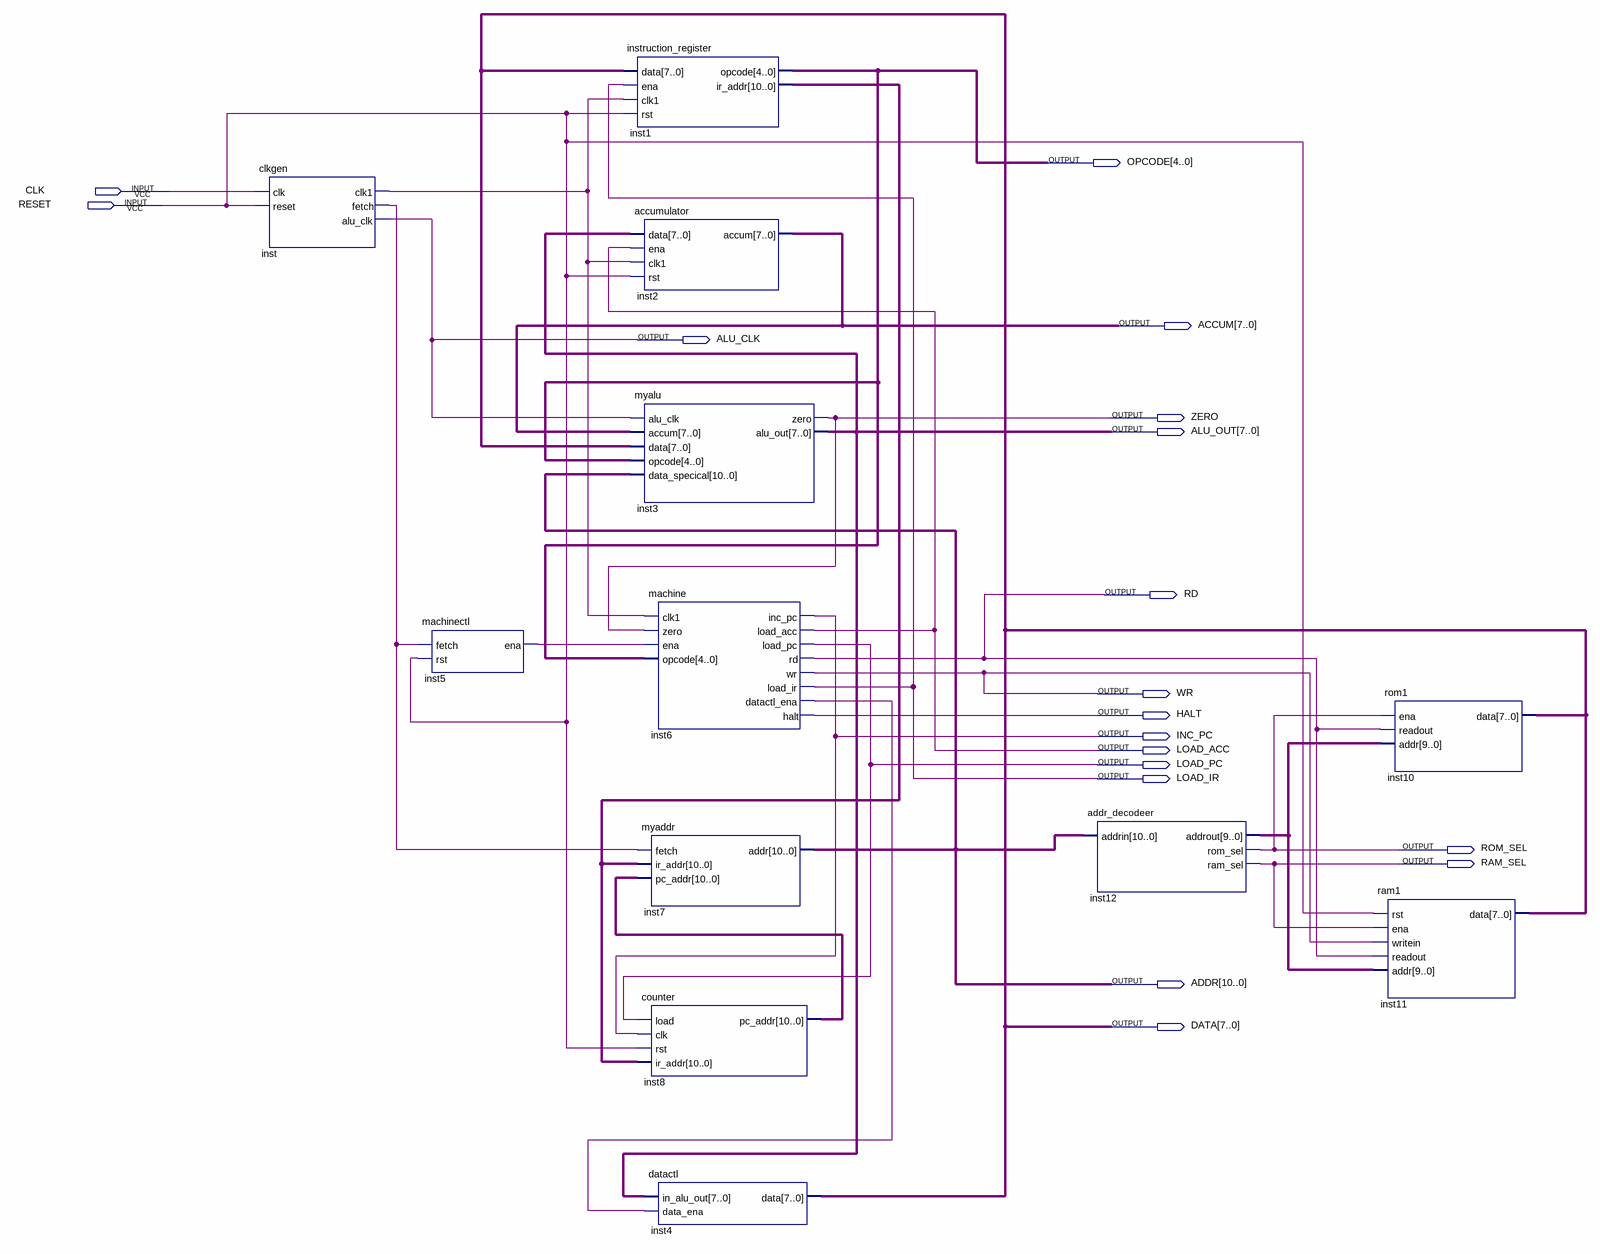
[diagram p0: schematic sheet]
// Quartus schematic RISC_CPU_TPO.bdf as structural Verilog: 12 symbols, 18 pins
module RISC_CPU_TPO (
  input  CLK,
  input  RESET,
  output [4:0] OPCODE,
  output [7:0] ACCUM,
  output ALU_CLK,
  output ZERO,
  output [7:0] ALU_OUT,
  output RD,
  output WR,
  output HALT,
  output INC_PC,
  output LOAD_ACC,
  output LOAD_PC,
  output LOAD_IR,
  output ROM_SEL,
  output RAM_SEL,
  output [10:0] ADDR,
  output [7:0] DATA
);

  wire inst5_ena, inst6_datactl_ena, inst_clk1, inst_fetch;
  wire [9:0] inst12_addrout;
  wire [10:0] inst1_ir_addr, inst8_pc_addr;

  clkgen inst (.clk(CLK), .reset(RESET), .clk1(inst_clk1), .fetch(inst_fetch), .alu_clk(ALU_CLK));
  machinectl inst5 (.fetch(inst_fetch), .rst(RESET), .ena(inst5_ena));
  instruction_register inst1 (
    .data(DATA), .ena(LOAD_IR), .clk1(inst_clk1), .rst(RESET), .opcode(OPCODE), .ir_addr(inst1_ir_addr));
  accumulator inst2 (.data(ALU_OUT), .ena(LOAD_ACC), .clk1(inst_clk1), .rst(RESET), .accum(ACCUM));
  myalu inst3 (
    .alu_clk(ALU_CLK), .accum(ACCUM), .data(DATA), .opcode(OPCODE), .data_specical(ADDR), .zero(ZERO),
    .alu_out(ALU_OUT));
  machine inst6 (
    .clk1(inst_clk1), .zero(ZERO), .ena(inst5_ena), .opcode(OPCODE), .inc_pc(INC_PC), .load_acc(LOAD_ACC),
    .load_pc(LOAD_PC), .rd(RD), .wr(WR), .load_ir(LOAD_IR), .datactl_ena(inst6_datactl_ena), .halt(HALT));
  myaddr inst7 (.fetch(inst_fetch), .ir_addr(inst1_ir_addr), .pc_addr(inst8_pc_addr), .addr(ADDR));
  counter inst8 (.load(LOAD_PC), .clk(INC_PC), .rst(RESET), .ir_addr(inst1_ir_addr), .pc_addr(inst8_pc_addr));
  datactl inst4 (.in_alu_out(ALU_OUT), .data_ena(inst6_datactl_ena), .data(DATA));
  addr_decodeer inst12 (.addrin(ADDR), .addrout(inst12_addrout), .rom_sel(ROM_SEL), .ram_sel(RAM_SEL));
  rom1 inst10 (.ena(ROM_SEL), .readout(RD), .addr(inst12_addrout), .data(DATA));
  ram1 inst11 (.rst(RESET), .ena(RAM_SEL), .writein(WR), .readout(RD), .addr(inst12_addrout), .data(DATA));
endmodule
